# EAGLE design PumpMonitoring (EAGLE 7.6.0)
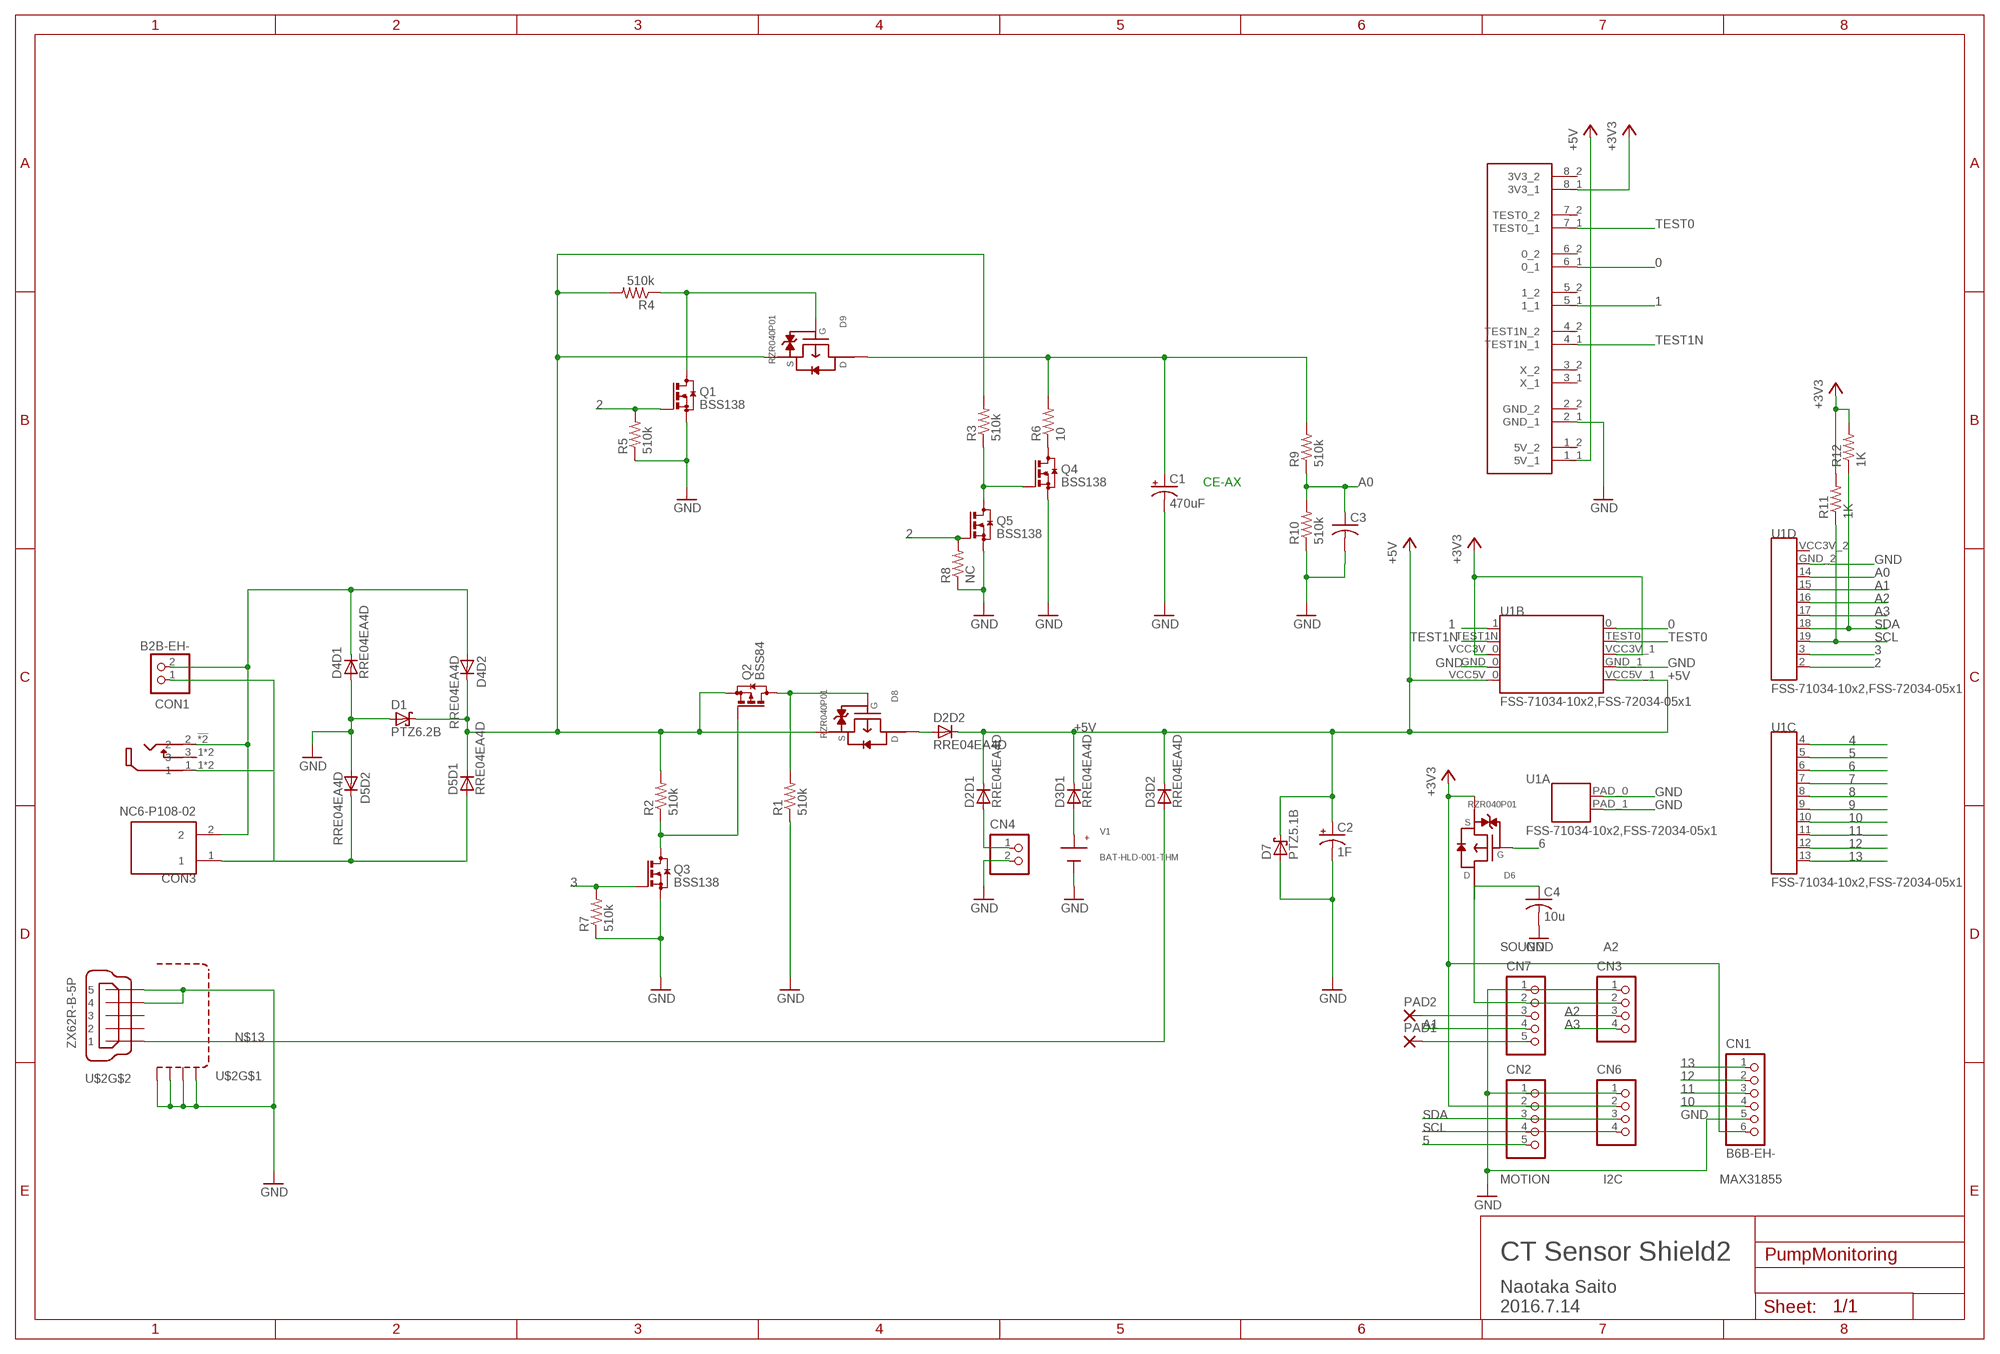
[diagram p0: schematic, sheet 1]

## Parts
C1  470uF  CPOL-USE5-10.5  [E5-10,5]
C2  1F  CPOL-USE5-20  [E5-20]
C3  C-USC0603  [C0603]
C4  10u  C-USC1206  [C1206]
CN1  B6B-EH-  [B6B-EH]
CN2  B5B-PH-K-S  [B5B-PH-K-S]
CN3  B4B-PH-K-S  [B4B-PH-K-S]
CN4  B2B-PH-K-S  [B2B-PH-K-S]
CN6  B4B-PH-K-S  [B4B-PH-K-S]
CN7  B5B-PH-K-S  [B5B-PH-K-S]
CON1  B2B-EH-  [B2B-EH]
CON2  MJ-3536N  [MJ-3536N]
CON3  NC6-P108-02  TE-NC6-P108-02  [2PIN]
D1  PTZ6.2B  PTZXXB  [DO214AC]
D2  RRE04EA4D  [TSMD5]
D3  RRE04EA4D  [TSMD5]
D4  RRE04EA4D  [TSMD5]
D5  RRE04EA4D  [TSMD5]
D6  RZR040P01  [TSMT3]
D7  PTZ5.1B  PTZXXB  [DO214AC]
D8  RZR040P01  [TSMT3]
D9  RZR040P01  [TSMT3]
PAD1  1,6/0,9  [1,6/0,9]
PAD2  1,6/0,9  [1,6/0,9]
Q1  BSS138  BSS123  [SOT23]
Q2  BSS84  [SOT23]
Q3  BSS138  BSS123  [SOT23]
Q4  BSS138  BSS123  [SOT23]
Q5  BSS138  BSS123  [SOT23]
R1  510k  R-US_R0603  [R0603]
R2  510k  R-US_R0603  [R0603]
R3  510k  R-US_R0603  [R0603]
R4  510k  R-US_R0603  [R0603]
R5  510k  R-US_R0603  [R0603]
R6  10  MCR18  [EZP]
R7  510k  R-US_R0603  [R0603]
R8  NC  R-US_R0603  [R0603]
R9  510k  R-US_R0603  [R0603]
R10  510k  R-US_R0603  [R0603]
R11  1K  R-US_R0603  [R0603]
R12  1K  R-US_R0603  [R0603]
U1  FSS-71034-10x2,FSS-72034-05x1  LAZURITE920JLAZURITE920J  [LAZURITE920J]
U$1  XB-1-X  [XB-1-X]
U$2  ZX62R-B-5P  MICRO-USB-SHIELD-ZX62R-B-5P  [ZX62R-B-5P]
V1  BAT-HLD-001-THM  [CR2032]

## Nets
0: U1.0 U$1.6_1(0_1)
1: U1.1 U$1.5_1(1_1)
2: Q1.1(G) Q5.1(G) R5.2 R8.2 U1.2
3: Q3.1(G) R7.2 U1.3
4: U1.4
5: CN2.5 U1.5
6: D6.1(G) U1.6
7: U1.7
8: U1.8
9: U1.9
10: CN1.4 U1.10
11: CN1.3 U1.11
12: CN1.2 U1.12
13: CN1.1 U1.13
+3V3: CN1.6 CN2.2 CN6.2 D6.2(S) R11.2 R12.2 U1.VCC3V_0(B:VCC3V_0) U1.VCC3V_1(B:VCC3V_1) U$1.8_1(3V3_1)
+5V: C2.+ D2.4(D2:C) D2.5(D1:C) D3.4(D2:C) D3.5(D1:C) D7.C U1.VCC5V_0(B:VCC5V_0) U1.VCC5V_1(B:VCC5V_1) U$1.1_1(5V_1)
A0: C3.1 R9.1 R10.2 U1.14
A1: CN7.4 U1.15
A2: CN3.3 U1.16
A3: CN3.4 U1.17
GND: C1.- C2.- C3.2 C4.2 CN1.5 CN2.1 CN3.1 CN4.2 CN6.1 CN7.1 D1.A D4.1(D1:A) D5.3(D2:A) D7.A Q1.2(S) Q3.2(S) Q4.2(S) Q5.2(S) R1.1 R5.1 R7.1 R8.1 R10.1 U1.GND_0(B:GND_0) U1.GND_1(B:GND_1) U1.GND_2(D:GND_2) U1.PAD_0(A:PAD_0) U1.PAD_1(A:PAD_1) U$1.2_1(GND_1) U$2.4 U$2.5 U$2.M1(S1) U$2.M2(S2) U$2.M3(S3) U$2.M4(S4) V1.GND
I+: CON1.2 CON2.2_2 CON2.2_! CON3.2 D4.3(D2:A) D4.5(D1:C)
I-: CON1.1 CON2.1_1 CON2.1_2 CON3.1 D5.1(D1:A) D5.4(D2:C)
IOUT: D1.C D4.4(D2:C) D5.5(D1:C) D8.2(S) D9.2(S) Q2.2(S) R2.2 R3.2 R4.2
N$1: D8.1(G) Q2.3(D) R1.2
N$2: D3.1(D1:A) V1.VDD1(VDD) V1.VDD2(VDD) V1.VDD3(VDD) V1.VDD4(VDD)
N$3: CN4.1 D2.1(D1:A)
N$4: C4.1 CN3.2 CN7.2 D6.3(D)
N$5: Q2.1(G) Q3.3(D) R2.1
N$6: CN7.5 PAD1.1(P)
N$7: D9.1(G) Q1.3(D) R4.1
N$8: CN7.3 PAD2.1(P)
N$9: Q4.3(D) R6.1
N$10: C1.+ D9.3(D) R6.2 R9.2
N$11: Q4.1(G) Q5.3(D) R3.1
N$12: D2.3(D2:A) D8.3(D)
N$13: D3.3(D2:A) U$2.1
SCL: CN2.4 CN6.4 R11.1 U1.19
SDA: CN2.3 CN6.3 R12.1 U1.18
TEST0: U1.TEST0(B:TEST0) U$1.7_1(TEST0_1)
TEST1N: U1.TEST1N(B:TEST1N) U$1.4_1(TEST1N_1)
Unconnected: CON2.3_1 CON2.3_2 U1.VCC3V_2(D:VCC3V_2) U$1.1_2(5V_2) U$1.2_2(GND_2) U$1.3_1(X_1) U$1.3_2(X_2) U$1.4_2(TEST1N_2) U$1.5_2(1_2) U$1.6_2(0_2) U$1.7_2(TEST0_2) U$1.8_2(3V3_2) U$2.2 U$2.3

## Notes on the sheet
- CE-AX
- SOUND | A2
- MOTION | I2C | MAX31855
- CT Sensor Shield2
- Naotaka Saito
  2016.7.14

## Library data of the parts
C1 C2 = rcl:CPOL-US: POLARIZED CAPACITOR, American symbol
C3 = resistor:C-US: CAPACITOR, American symbol
C4 = rcl:C-US: CAPACITOR, American symbol
CN1 = jst-ph:B6B-EH-*
CN2 CN7 = jst-ph:B5B-PH-*: Wire-to-Board 2.0mm pitch top mount connector Source: http://www.jst-mfg.com/product/pdf/jpn/PH.pdf http://www.jst-mfg.com/product/detail.php?series=199
CN3 CN6 = jst-ph:B4B-PH-*: Wire-to-Board 2.0mm pitch top mount connector Source: http://www.jst-mfg.com/product/pdf/jpn/PH.pdf http://www.jst-mfg.com/product/detail.php?series=199
CN4 = jst-ph:B2B-PH-*: Wire-to-Board 2.0mm pitch top mount connector Source: http://www.jst-mfg.com/product/pdf/jpn/PH.pdf http://www.jst-mfg.com/product/detail.php?series=199
CON1 = jst-ph:B2B-EH-*
CON2 = mouser:MJ-3536N: Mouser 部品番号： 490-MJ-3536N メーカ部品番号：MJ-3536N メーカ: CUI 詳細：フォーンコネクタ Audio Jacks URL: click <http://www.mouser.jp/ProductDetail/CUI/MJ-3536N/?qs=sGAEpiMZZMv0W4pxf2HiVz9SCMkER55fgU4mAJR6d6TaQPgwlv6tnA%3d%3d>
CON3 = lz-shield:TE-NC6-P108-02: TE-Connectivity-AMP-Connectors NC6-P108-02 http://www.digikey.jp/product-detail/ja/te-connectivity-amp-connectors/NC6-P108-02/A98495-ND/1277926
D1 D7 = rohm2:PTZXXB
D2-D5 = rohm2:RRE04EA4D
D6 D8 D9 = rohm2:RZR040P01
PAD1 PAD2 = wirepad:1,6/0,9: THROUGH-HOLE PAD
Q1 Q3-Q5 = transistor-small-signal:BSS123: N-CHANNEL MOS FET
Q2 = transistor-small-signal:BSS84: P-CHANNEL MOS FET
R1-R5 R7-R12 = resistor:R-US_: RESISTOR, American symbol
R6 = rohm2:MCR18
U1 = lazurite:LAZURITE920J: Lazurite 920J HIROSUGI PSS-710103-10 1.27pitch 1x10pin pin header x 2pcs HIROSUGI PSS-720102-05 1.27pitch 2x5pin pin header
U$1 = lz-shield:XB-1-X
U$2 = con-hirose:MICRO-USB-SHIELD-: Hirose Micro USB Connector ZX62R-B-5P: Micro B, reverse (top mount) shell SMT Supplier: DigiKey H11574CT-ND Source: http://www.hirose.co.jp/cataloge_hp/e24200011.pdf
V1 = mouser:BAT-HLD-001-THM: Mouser 部品番号：712-BAT-HLD-001-THM メーカ部品番号：BAT-HLD-001-THM

## Board
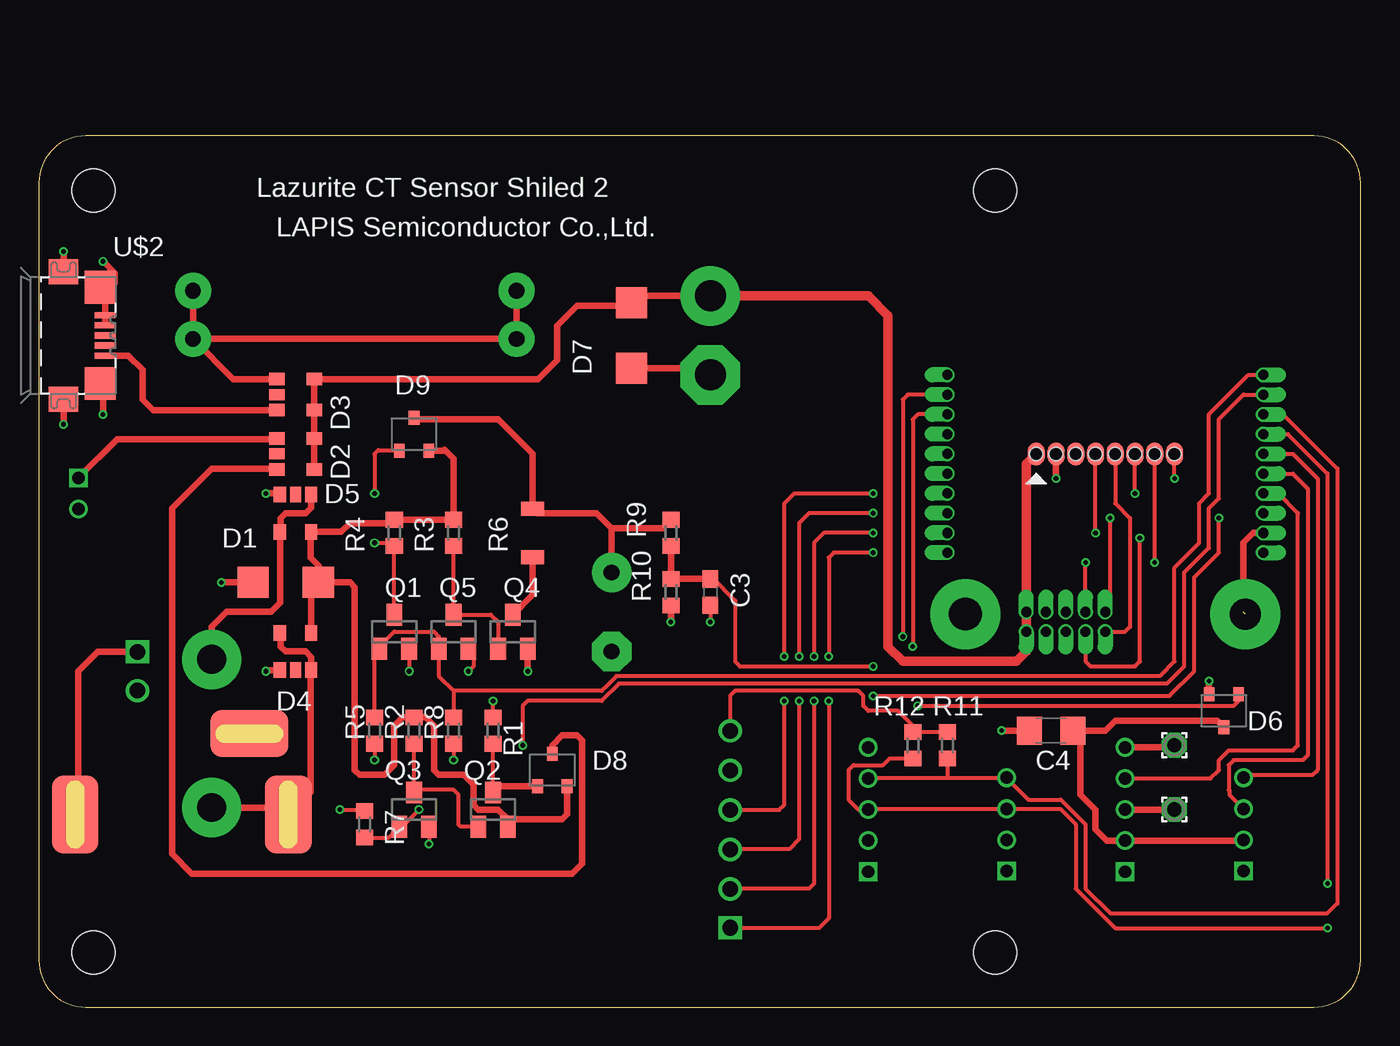
[diagram p1: board, top side]
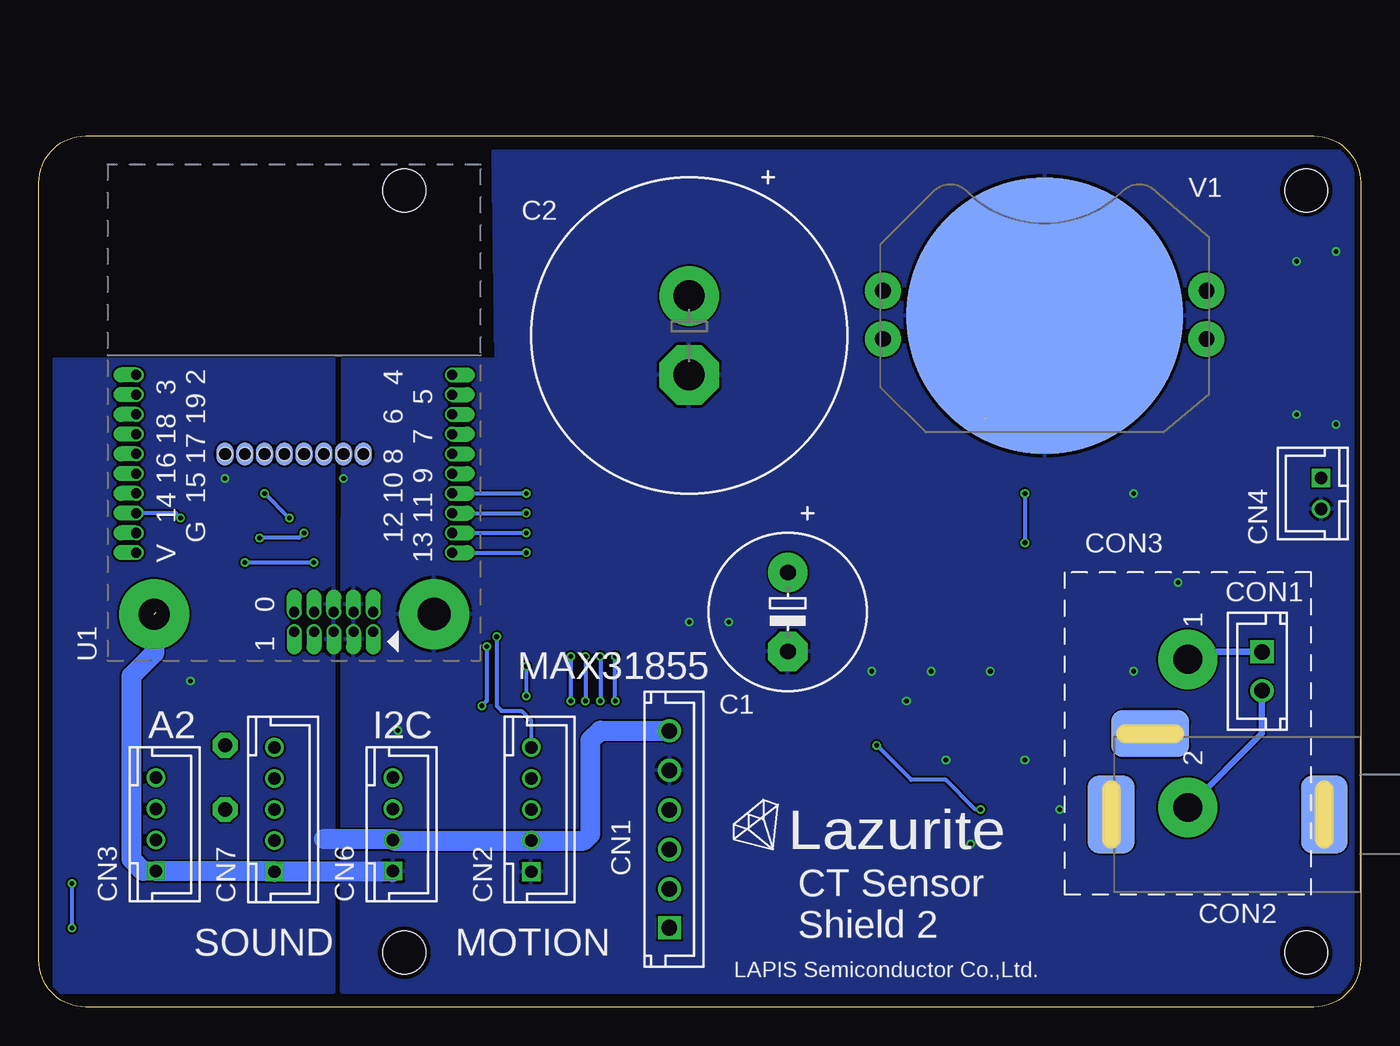
[diagram p2: board, bottom side, seen from below]

Size 85 x 56 mm. Coordinates in mm from the lower left corner, seen from the top.
Outline: 0,3 arc90 3,0 82,0 arc90 85,3 85,53 arc90 82,56 3,56 arc90 0,53 0,3
Copper layers (1+2*3+16): Top 0.018mm / dielectric 0.36mm / Route2 0.035mm / dielectric 0.71mm / Route3 0.035mm / dielectric 0.36mm / Bottom 0.018mm
Design rules "unicraft_4_layer": minimum track width 0.125mm, minimum drill 0.3mm, track to track 0.125mm, track to pad 0.125mm, pad to pad 0.125mm, via to via 0.125mm, smd to smd 0mil, copper to edge 0.3mm, drill to drill 0.2mm, minimum pad ring 0.125mm, minimum via ring 0.125mm, stop-mask expansion 2mil, vias tented up to drill 0.45mm, thermal gap 0.2mm
Holes 2.75 mm at 3.5,52.5 3.5,3.5 61.5,3.5 61.5,52.5

### Footprints (pad centres in the part's own frame; a part is rotated, then mirrored left to right if it is on the bottom)
E5-10,5 = drill 1.016 pad 2.54: + -2.54,0 | drill 1.016 pad 2.54 octagon: - 2.54,0
E5-20 = drill 2 pad 3.81: + -2.54,0 | drill 2 pad 3.81 octagon: - 2.54,0
C0603 = smd 1.1 x 1: 1 -0.85,0; 2 0.85,0
C1206 = smd 1.6 x 1.8: 1 -1.4,0; 2 1.4,0
B6B-EH = drill 1 square: 1 -6.33,0 | drill 1: 2 -3.83,0; 3 -1.29,0; 4 1.25,0; 5 3.79,0; 6 6.33,0
B5B-PH-K-S = drill 0.8 square: 1 -4,0 | drill 0.8: 2 -2,0; 3 0,0; 4 2,0; 5 4,0
B4B-PH-K-S = drill 0.8 square: 1 -3,0 | drill 0.8: 2 -1,0; 3 1,0; 4 3,0
B2B-PH-K-S = drill 0.8 square: 1 -1,0 | drill 0.8: 2 1,0
B2B-EH = drill 1 square: 1 -1.25,0 | drill 1: 2 1.25,0
MJ-3536N = smd 3 x 5: 1_1 -5.6,0; 2_! 8.1,0 | smd 3 x 5 bottom: 1_2 -5.6,0; 2_2 8.1,0 | smd 5 x 3: 3_1 5.6,-5.2 | smd 5 x 3 bottom: 3_2 5.6,-5.2
2PIN = drill 1.854 pad 3.81: 1 5.588,7.938; 2 15.113,7.938
DO214AC = smd 2 x 2: A -2.1,0; C 2.1,0
TSMD5 = smd 0.8 x 1: 1 -1,-1.2; 3 1,-1.2; 4 1,1.2; 5 -1,1.2 | smd 0.7 x 1: 2 0,-1.2
TSMT3 = smd 0.7 x 0.9: 1 -0.95,-1.05; 2 0.95,-1.05; 3 0,1.05
1,6/0,9 = drill 0.914 pad 1.6 octagon: 1 0,0
SOT23 = smd 1 x 1.4: 1 -0.95,-1.1; 2 0.95,-1.1; 3 0,1.1
R0603 = smd 1 x 1.1: 1 -0.85,0; 2 0.85,0
EZP = smd 0.9 x 1.5: 1 -1.55,0; 2 1.55,0
LAZURITE920J = drill 0.65 pad 0.8 offset: 0 1.27,5.08; 1 0,5.08; 2 16.51,15.24; 3 15.24,15.24; 4 16.51,-5.08; 5 15.24,-5.08; 6 13.97,-5.08; 7 12.7,-5.08; 8 11.43,-5.08; 9 10.16,-5.08; 10 8.89,-5.08; 11 7.62,-5.08; 12 6.35,-5.08; 13 5.08,-5.08; 14 7.62,15.24; 15 8.89,15.24; 16 10.16,15.24; 17 11.43,15.24; 18 12.7,15.24; 19 13.97,15.24; GND_0 0,1.27; GND_1 1.27,1.27; GND_2 6.35,15.24; TEST0 1.27,3.81; TEST1N 0,3.81; VCC3V_0 0,2.54; VCC3V_1 1.27,2.54; VCC3V_2 5.08,15.24; VCC5V_0 0,0; VCC5V_1 1.27,0 | drill 2.1 pad 4.5: PAD_0 1.135,-3.92 | drill 2 pad 4.5: PAD_1 1.135,14.08
XB-1-X = smd 1.1 x 1.5: 1_1 3.81,0; 2_1 2.54,0; 3_1 1.27,0; 4_1 0,0; 5_1 -1.27,0; 6_1 -2.54,0; 7_1 -3.81,0; 8_1 -5.08,0 | smd 1.1 x 1.5 bottom: 1_2 3.81,0; 2_2 2.54,0; 3_2 1.27,0; 4_2 0,0; 5_2 -1.27,0; 6_2 -2.54,0; 7_2 -3.81,0; 8_2 -5.08,0 | hole 0.85: -5.08,0; -3.81,0; -2.54,0; -1.27,0; 0,0; 1.27,0; 2.54,0; 3.81,0
ZX62R-B-5P = smd 1.35 x 0.4: 1 2.675,-1.3; 2 2.675,-0.65; 3 2.675,0; 4 2.675,0.65; 5 2.675,1.3 | smd 1.9 x 1.6: M1 0,-4.1; M2 0,4.1 | smd 2 x 2.1: M3 2.35,3.1; M4 2.35,-3.1
CR2032 = smd 17.8 x 17.8: GND 0,0 | drill 1 pad 2.3: VDD1 -10.4,1.5; VDD2 -10.4,-1.6; VDD3 10.4,1.5; VDD4 10.4,-1.6

### Placement (x,y rotation side)
C1  36.83,25.4 270 bottom
C2  43.18,43.18 270 bottom
C3  43.18,26.67 270 top
C4  65.09,17.78 180 top
CN1  44.45,11.43 90 bottom
CN2  53.34,12.7 90 bottom
CN3  77.47,11.75 90 bottom
CN4  2.54,33.02 270 bottom
CN6  62.23,11.75 90 bottom
CN7  69.85,12.7 90 bottom
CON1  6.35,21.59 270 bottom
CON2  7.94,12.38 180 bottom
CON3  19.05,27.94 270 bottom
D1  15.88,27.3 0 top
D2  16.51,35.56 270 top
D3  16.51,39.37 270 top
D4  16.51,22.86 0 top
D5  16.51,31.75 180 top
D6  76.2,19.05 180 top
D7  38.1,43.18 90 top
D8  33.02,15.24 0 top
D9  24.13,36.83 0 top
PAD1  73.03,16.83 0 top
PAD2  73.03,12.7 0 top
Q1  22.86,24.13 0 top
Q2  29.21,12.7 0 top
Q3  24.13,12.7 0 top
Q4  30.48,24.13 0 top
Q5  26.67,24.13 0 top
R1  29.21,17.78 270 top
R2  24.13,17.78 90 top
R3  26.67,30.48 90 top
R4  22.86,30.48 90 top
R5  21.59,17.78 90 top
R6  31.75,30.48 90 top
R7  20.95,11.75 270 top
R8  26.67,17.78 90 top
R9  40.64,30.48 90 top
R10  40.64,26.67 90 top
R11  58.42,16.83 90 top
R12  56.2,16.83 90 top
U1  63.5,24.13 90 bottom
U$1  67.94,35.56 180 top
U$2  1.59,43.18 0 top
U$3  [LOGO]  40.96,10.48 0 bottom
V1  20.32,44.45 180 bottom

### Tracks (layer width: path | path; a pad name or v marks a point on that pad's centre or on a via)
0  (via drill 0.3)
  Top 0.254: U1.0 68.9,25.72 v68.9,31.43 | v70.48,33.02 U$1.6_1
  Bottom 0.254: v68.9,31.43 v70.48,33.02
1
  Top 0.254: U$1.5_1 69.22,32.38 70.17,31.43 70.17,24.45 69.85,24.13 U1.1
2
  Top 0.254: R5.2 21.59,22.71 Q1.1 21.91,23.18 22.86,24.13 25.4,24.13 25.72,23.81 Q5.1 25.72,21.27 26.67,20.32 | 26.67,20.32 R8.2 | U1.2 77.79,40.64 75.25,38.1 75.25,33.02 74.61,32.38 74.61,29.84 73.03,28.26 73.03,22.23 72.07,21.27 37.15,21.27 36.83,20.95 36.51,20.64 36.2,20.32 26.67,20.32
3  (via drill 0.3)
  Top 0.254: v24.45,12.7 23.35,11.6 Q3.1 22.48,10.9 R7.2 | U1.3 77.47,39.37 75.88,37.78 75.88,32.7 75.25,32.07 75.25,29.53 73.66,27.94 73.66,21.91 72.55,20.8 37.31,20.8 36.2,19.68 31.43,19.68 31.11,19.37 v31.11,16.83
  Bottom 0.254: v24.45,12.7 24.77,12.7 26.67,14.61 28.89,14.61 v31.11,16.83
5  (via drill 0.3)
  Top 0.254: U1.5 55.88,39.37 55.56,39.05 v55.56,23.81
  Bottom 0.254: v55.56,23.81 55.56,19.37 55.24,19.05 53.98,19.05 53.34,18.41 CN2.5
6  (via drill 0.3)
  Top 0.254: v56.52,19.37 76.83,19.37 77.15,19.68 D6.1 | U1.6 56.52,38.1 56.2,37.78 v56.2,23.18
  Bottom 0.254: v56.2,23.18 56.2,19.68 v56.52,19.37
10  (via drill 0.3)
  Top 0.254: CN1.4 47.6,12.68 47.94,13.02 v47.94,19.68 | v47.94,22.54 47.94,32.38 48.58,33.02 v53.66,33.02
  Bottom 0.254: U1.10 v53.66,33.02 | v47.94,19.68 v47.94,22.54
11  (via drill 0.3)
  Top 0.254: v53.66,31.75 49.53,31.75 48.9,31.11 v48.9,22.54 | v48.9,19.68 48.9,10.79 48.26,10.16 44.47,10.16 CN1.3
  Bottom 0.254: U1.11 v53.66,31.75 | v48.9,22.54 v48.9,19.68
12  (via drill 0.3)
  Top 0.254: v53.66,30.48 50.48,30.48 49.85,29.84 v49.85,22.54 | v49.85,19.68 49.85,7.94 49.53,7.62 44.47,7.62 CN1.2
  Bottom 0.254: U1.12 v53.66,30.48 | v49.85,22.54 v49.85,19.68
13  (via drill 0.3)
  Top 0.254: v53.66,29.21 51.12,29.21 50.8,28.89 v50.8,22.54 | v50.8,19.68 50.8,5.71 50.16,5.08 44.47,5.08 CN1.1
  Bottom 0.254: U1.13 v53.66,29.21 | v50.8,22.54 v50.8,19.68
+3V3  (via drill 0.3)
  Top 0.254: v73.03,33.97 U$1.8_1 | R11.2 R12.2 56.2,18.1 55.24,19.05 53.34,19.05 53.02,19.37 53.02,20 52.7,20.32 44.77,20.32 44.45,20 CN1.6
  Top 0.406: v75.25,20.95 D6.2
  Bottom 0.406: CN6.2 62.18,10.7
  Bottom 1.27: 62.18,10.7 CN2.2 49.94,10.7 49.53,11.11 49.53,17.14 48.9,17.78 44.47,17.78 CN1.6 | CN6.2 62.28,10.79 66.67,10.79
  pour Bottom: 66.04,41.62 84,41.62 84,1 66.04,1
+5V
  Top 0.406: C2.+ 38.54,45.72 D7.C 37.91,45.09 34.61,45.09 33.34,43.81 33.34,41.59 32.12,40.37 D3.5 D3.4 D2.5 D2.4
  Top 0.61: C2.+ 53.34,45.72 54.61,44.45 54.61,23.18 55.56,22.23 62.87,22.23 63.5,22.86 U1.VCC5V_0 U1.VCC5V_1 63.5,34.92 U$1.1_1
A0  (via drill 0.3)
  Top 0.254: v53.66,20 72.71,20 74.3,21.59 74.3,27.62 75.88,29.21 v75.88,31.43 | 43.28,27.62 44.77,26.14 44.77,22.23 45.09,21.91 v53.66,21.91
  Top 0.406: R9.1 R10.2 C3.1 43.28,27.62
  Bottom 0.254: v75.88,31.43 76.2,31.75 U1.14 | v53.66,21.91 v53.66,20
A1
  Top 0.254: U1.15 79.69,33.02 80.96,31.75 80.96,16.83 80.64,16.51 76.52,16.51 75.88,15.88 75.88,15.24 75.34,14.7 CN7.4
A2
  Top 0.254: 77.52,12.7 CN3.3 76.56,13.65 76.56,13.92 76.52,13.97 76.52,15.56 76.83,15.88 81.28,15.88 81.6,16.19 81.6,33.34 80.64,34.29 U1.16
A3
  Top 0.254: U1.17 80.64,35.56 82.23,33.97 82.23,15.24 81.92,14.92 77.64,14.92 CN3.4
GND  (via drill 0.3)  (1 unrouted)
  Top 0.254: Q3.2 v25.08,10.48 | R5.1 v21.59,15.88 | R8.1 v26.67,15.88 | R1.1 v29.21,19.68 | Q5.2 27.94,22.71 27.94,21.91 v27.62,21.59 | Q1.2 v23.81,21.59 | 4.89,46.55 U$2.M3 | v19.37,12.7 20.85,12.7 R7.1 | C3.2 v43.18,24.77
  Top 0.406: v31.43,21.59 Q4.2 | v65.41,33.97 U$1.2_1 | 77.47,25.38 77.47,29.84 78.11,30.48 U1.GND_2 | C4.2 v61.91,17.78 | v40.64,24.77 R10.1 | C2.- 42.74,41.08 D7.A | v1.59,37.47 U$2.M1 | v4.13,38.1 4.13,39.89 U$2.M4 | U$2.4 U$2.5 4.26,45.95 U$2.M3 | 4.89,46.55 4.89,47.18 v4.13,47.94 | U$2.M2 v1.59,48.58 | D1.A v11.75,27.3 | D4.1 14.68,21.66 v14.61,21.59 | v14.61,33.02 15.44,33.02 D5.3
  Bottom 0.406: CN6.1 62.28,8.7 | CN7.1 69.9,8.75 | 78.28,8.75 CN3.1
  Bottom 1.27: 62.28,8.7 CN7.1 | 69.9,8.75 CN3.1 | U1.PAD_1 77.58,22.75 79.06,21.27 79.06,9.53 78.28,8.75
  pour Bottom: 0.5,55 55.79,55 55.59,41.62 65.45,41.62 65.53,1 0.5,1
I+  (1 unrouted)
  Top 0.406: D4.5 15.56,24.01 15.56,23.18 15.88,22.86 17.14,22.86 17.51,22.5 D4.3 17.46,21.61 17.46,13.81 CON2.2_! 16.04,12.83 CON3.2
  Bottom 0.406: CON3.2 6.35,17.59 CON1.2
I-  (1 unrouted)
  Top 0.406: CON2.1_2 2.54,12.59 2.54,21.59 3.79,22.84 CON1.1 | D5.1 17.51,32.12 17.14,31.75 15.88,31.75 15.56,31.43 15.56,30.6 D5.4 15.51,25.99 14.92,25.4 12.06,25.4 11.11,24.45 CON3.1
  Bottom 0.406: CON3.1 10.62,22.84 CON1.1
IOUT
  Top 0.406: 30.16,12.06 29.53,12.7 28.26,12.7 27.94,13.02 27.94,14.29 27.3,14.92 25.72,14.92 25.4,15.24 25.4,18.1 24.87,18.63 R2.2 23.39,18.63 22.86,18.1 22.86,15.56 22.23,14.92 20.64,14.92 20.32,15.24 20.32,26.99 20,27.3 D1.C | 30.16,12.06 Q2.2 | D9.2 26.1,35.78 26.1,35.81 26.67,35.24 R3.2 R4.2 22.64,31.11 20,31.11 19.44,30.55 D5.5 17.46,30.5 17.46,28.89 17.98,28.38 D1.C | 30.16,12.06 33.66,12.06 33.97,12.38 D8.2 | D4.4 17.51,26.84 D1.C
N$1
  Top 0.254: Q2.3 R1.2
  Top 0.406: D8.1 29.6,14.19 Q2.3
N$2
  Top 0.406: V1.VDD2 V1.VDD1 | V1.VDD4 V1.VDD3 V1.VDD1 | V1.VDD1 12.5,40.37 D3.1
N$3
  Top 0.406: D2.1 15.26,36.51 5.03,36.51 CN4.1
N$4
  Top 0.406: D6.3 75.78,18.41 69.22,18.41 68.58,17.78 66.99,17.78 | CN3.2 77.42,10.7 CN7.2 68.67,10.7 67.94,11.43 67.94,12.7 66.99,13.65 66.99,17.78 | 66.99,17.78 C4.1
N$5
  Top 0.254: Q2.1 27.14,11.6 26.99,11.75 26.99,13.65 26.67,13.97 24.3,13.97 Q3.3 R2.1
N$6
  Top 0.406: PAD1.1 72.9,16.7 CN7.5
N$7  (via drill 0.3)
  Top 0.254: Q1.3 R4.1 22.64,29.84 v21.59,29.84 | v21.59,33.02 21.59,35.56 21.84,35.81 21.84,35.78 D9.1
  Bottom 0.254: v21.59,33.02 v21.59,29.84
N$8
  Top 0.406: PAD2.1 CN7.3
N$9
  Top 0.406: R6.1 31.75,26.5 Q4.3
N$10  (1 unrouted)
  Top 0.406: 24.17,37.78 29.53,37.78 31.75,35.56 R6.2 32.03,31.75 35.88,31.75 36.83,30.8 | C1.+ 36.83,30.8 | 36.83,30.8 40.11,30.8 R9.2
N$11
  Top 0.254: Q4.1 29.53,24.77 29.06,25.23 Q5.3 R3.1
N$12
  Top 0.406: D8.3 33.02,16.83 33.66,17.46 34.61,17.46 34.92,17.14 34.92,9.21 34.29,8.57 9.84,8.57 8.57,9.84 8.57,32.07 11.11,34.61 15.26,34.61 D2.3
N$13
  Top 0.406: D3.3 7.35,38.37 6.67,39.05 6.67,40.96 5.75,41.88 U$2.1
SCL
  Top 0.254: CN2.4 53.39,14.75 58.42,14.75 | 58.42,14.75 CN6.4 63.64,13.34 65.72,13.34 67.31,11.75 67.31,7.62 68.9,6.03 82.87,6.03 83.5,6.67 83.5,34.61 80.01,38.1 U1.19 | R11.1 58.42,14.75
SDA  (via drill 0.3)
  Top 0.254: U1.18 80.33,36.83 82.87,34.29 v82.87,7.94 | v82.87,5.08 69.22,5.08 66.67,7.62 66.67,11.75 65.67,12.75 CN6.3 53.39,12.75 CN2.3 52.7,12.7 52.07,13.34 52.07,15.24 52.39,15.56 54.29,15.56 54.71,15.98 R12.1
  Bottom 0.254: v82.87,5.08 v82.87,7.94
TEST0  (via drill 0.3)
  Top 0.254: U1.TEST0 v67.31,28.57 | v71.75,28.57 U$1.7_1
  Bottom 0.254: v67.31,28.57 v71.75,28.57
TEST1N  (via drill 0.3)
  Top 0.254: v67.94,30.48 U$1.4_1 | U1.TEST1N 67.31,22.23 67.63,21.91 70.48,21.91 70.8,22.23 v70.8,30.16
  Bottom 0.254: v67.94,30.48 68.26,30.16 v70.8,30.16

### Text on the board
tPlace: Lazurite CT Sensor Shiled 2 | LAPIS Semiconductor Co.,Ltd.
bPlace: MAX31855 | I2C | A2 | Lazurite | MOTION | SOUND | CT Sensor / Shield 2 | LAPIS Semiconductor Co.,Ltd.